# EAGLE design Adafruit PB86 Breakout (EAGLE 9.6.2)
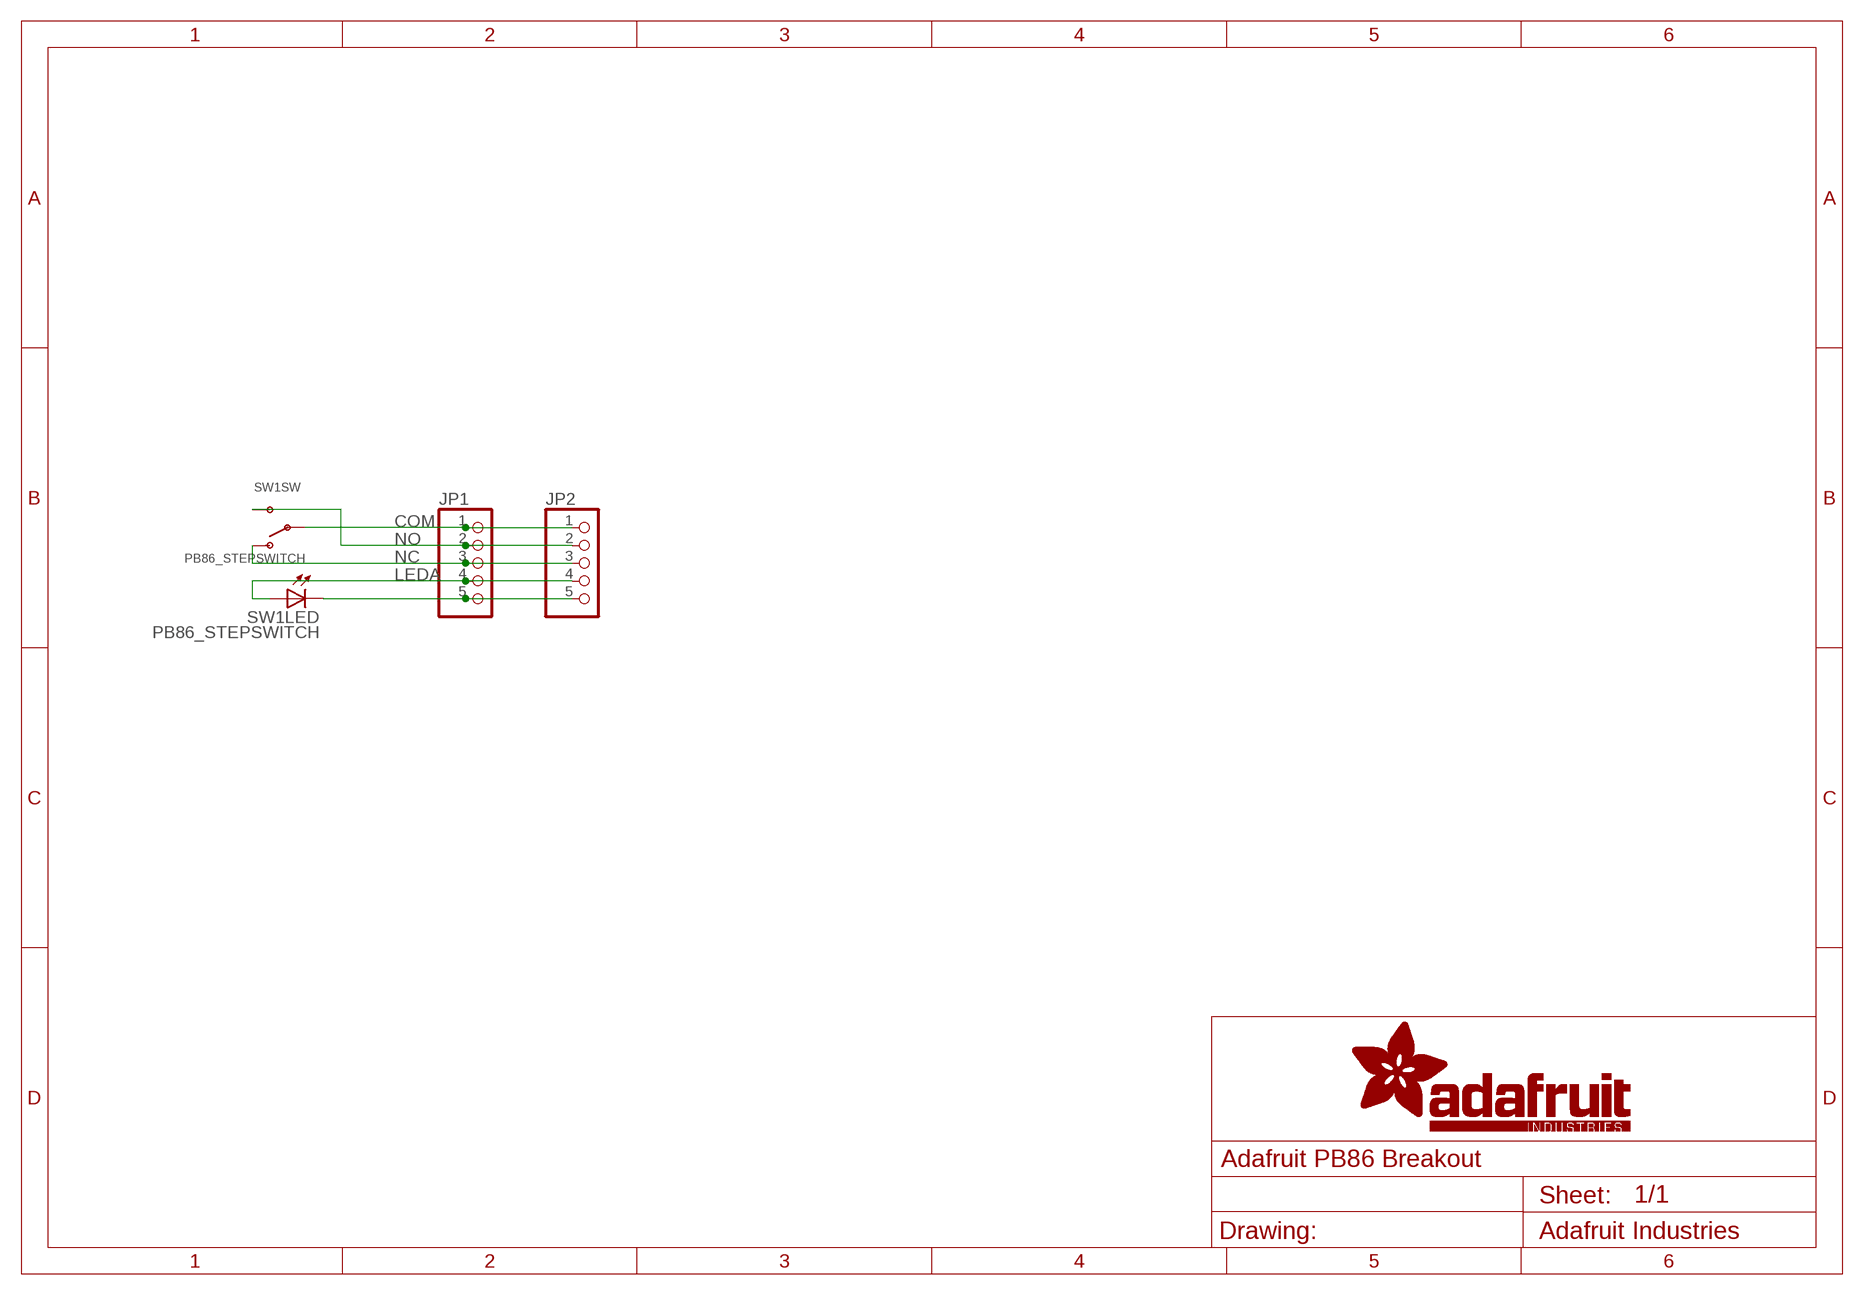
[diagram p0: schematic, sheet 1]

## Parts
JP1  HEADER-1X5ROUND  [1X05_ROUND]
JP2  HEADER-1X5ROUND  [1X05_ROUND]
SW1  PB86_STEPSWITCH  [PB86]

## Nets
COM: JP1.1 JP2.1 SW1.1A(SW:P) SW1.1B(SW:P)
LEDA: JP1.4 JP2.4 SW1.LED+(LED:A)
LEDC: JP1.5 JP2.5 SW1.LED-(LED:C)
NC: JP1.3 JP2.3 SW1.3(SW:O)
NO: JP1.2 JP2.2 SW1.2(SW:S)

## Library data of the parts
JP1 JP2 = microbuilder:HEADER-1X5: PIN HEADER
SW1 = adafruit_electromech:PB86_STEPSWITCH

## Net classes
1 highpower: width 0.406 mm, drill 0.483 mm
2 lowpower: width 0.305 mm, drill 0.483 mm

## Board
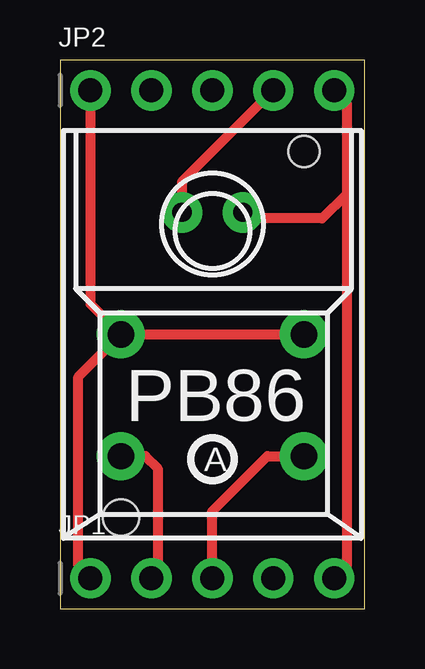
[diagram p1: board, top side]
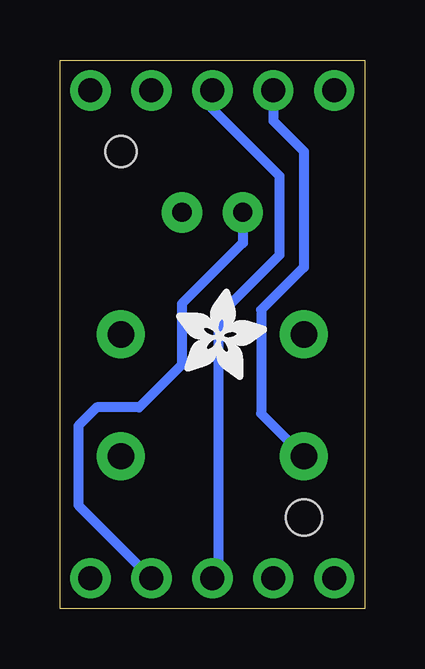
[diagram p2: board, bottom side, seen from below]

Size 12.7 x 22.86 mm. Coordinates in mm from the lower left corner, seen from the top.
Outline: 0,22.86 0,0 12.7,0 12.7,22.86 0,22.86
Copper layers (1*16): Top 0.035mm / dielectric 1.5mm / Bottom 0.035mm
Design rules "adafruit *": minimum track width 8mil, minimum drill 15.5mil, track to track 8mil, track to pad 8mil, pad to pad 8mil, via to via 8mil, smd to smd 8mil, copper to edge 10mil, drill to drill 8mil, minimum pad ring 10mil, minimum via ring 8mil, stop-mask expansion 2mil, vias tented up to drill 20mil, thermal gap 10mil

### Footprints (pad centres in the part's own frame; a part is rotated, then mirrored left to right if it is on the bottom)
1X05_ROUND = drill 1 pad 1.676: 1 -5.08,0; 2 -2.54,0; 3 0,0; 4 2.54,0; 5 5.08,0
PB86 = drill 1.1 pad 2: 1A -3.81,0; 1B 3.81,0; 2 -3.81,-5.08; 3 3.81,-5.08 | drill 0.8 pad 1.676: LED+ -1.27,5.08; LED- 1.27,5.08 | hole 1.5: -3.81,-7.625 | hole 1.3: 3.81,7.625

### Placement (x,y rotation side)
JP1  6.35,1.27 0 top
JP2  6.35,21.59 0 top
PLABEL0  [PLABEL0]  2.03,20.19 0 top
PLABEL1  [PLABEL1]  4.44,20.19 0 top
PLABEL2  [PLABEL2]  6.98,20.19 0 top
PLABEL3  [PLABEL3]  9.27,20.07 0 top
PLABEL4  [PLABEL4]  10.41,20.19 0 top
PLABEL5  [PLABEL5]  10.54,1.9 0 top
PLABEL6  [PLABEL6]  9.27,1.78 0 top
PLABEL7  [PLABEL7]  2.03,1.65 0 top
PLABEL8  [PLABEL8]  4.44,1.65 0 top
PLABEL9  [PLABEL9]  6.98,1.65 0 top
PLABEL10  [PLABEL10]  0.89,2.41 270 bottom
PLABEL11  [PLABEL11]  1.27,20.57 90 bottom
PLABEL12  [PLABEL12]  4.32,2.41 270 bottom
PLABEL13  [PLABEL13]  3.56,20.57 90 bottom
PLABEL14  [PLABEL14]  6.35,2.29 270 bottom
PLABEL15  [PLABEL15]  8.76,2.29 270 bottom
PLABEL16  [PLABEL16]  11.3,2.41 270 bottom
PLABEL17  [PLABEL17]  11.43,20.57 90 bottom
PLABEL18  [PLABEL18]  8.89,20.57 90 bottom
PLABEL19  [PLABEL19]  6.35,20.57 90 bottom
SW1  6.35,11.43 0 top
U$1  [PCBFEAT-REV-040]  6.35,6.22 0 top
U$32  [ADAFRUIT_3.5MM]  7.87,9.53 0 bottom

### Tracks (layer width: path | path; a pad name or v marks a point on that pad's centre or on a via)
COM
  Top 0.406: SW1.1A SW1.1B | JP2.1 1.27,12.7 SW1.1A | JP1.1 0.76,1.78 0.76,9.65 SW1.1A
LEDA
  Top 0.406: JP2.4 5.08,17.78 SW1.LED+
  Bottom 0.406: SW1.LED+ 5.08,15.24 7.62,12.7 7.62,10.16 9.4,8.38 11.18,8.38 11.94,7.62 11.94,4.32 JP1.4
LEDC
  Top 0.406: JP2.5 11.94,21.08 11.94,17.27 | 11.94,17.27 10.92,16.26 7.87,16.26 SW1.LED- | 11.94,17.27 11.94,1.78 JP1.5
NC
  Top 0.406: JP1.3 6.35,4.06 8.64,6.35 SW1.3
  Bottom 0.406: JP2.3 6.35,20.83 3.56,18.03 3.56,14.73 6.1,12.19 6.1,1.52 JP1.3
NO
  Top 0.406: SW1.2 3.56,6.35 4.06,5.84 4.06,1.52 JP1.2
  Bottom 0.406: JP2.2 3.81,20.32 2.54,19.05 2.54,14.22 4.32,12.45 4.32,8.13 SW1.2

### Text on the board
tPlace: PB86
Pinguin_tBackup: M | O | C | + | - | M | O | C | + | -
Pinguin_bBackup: COMMON | N.OPEN | N.CLOSED | LED+ | LED- | COMMON | N.OPEN | N.CLOSED | LED+ | LED-